# EAGLE design ADCMP607-step-gen (EAGLE 9.4.2)
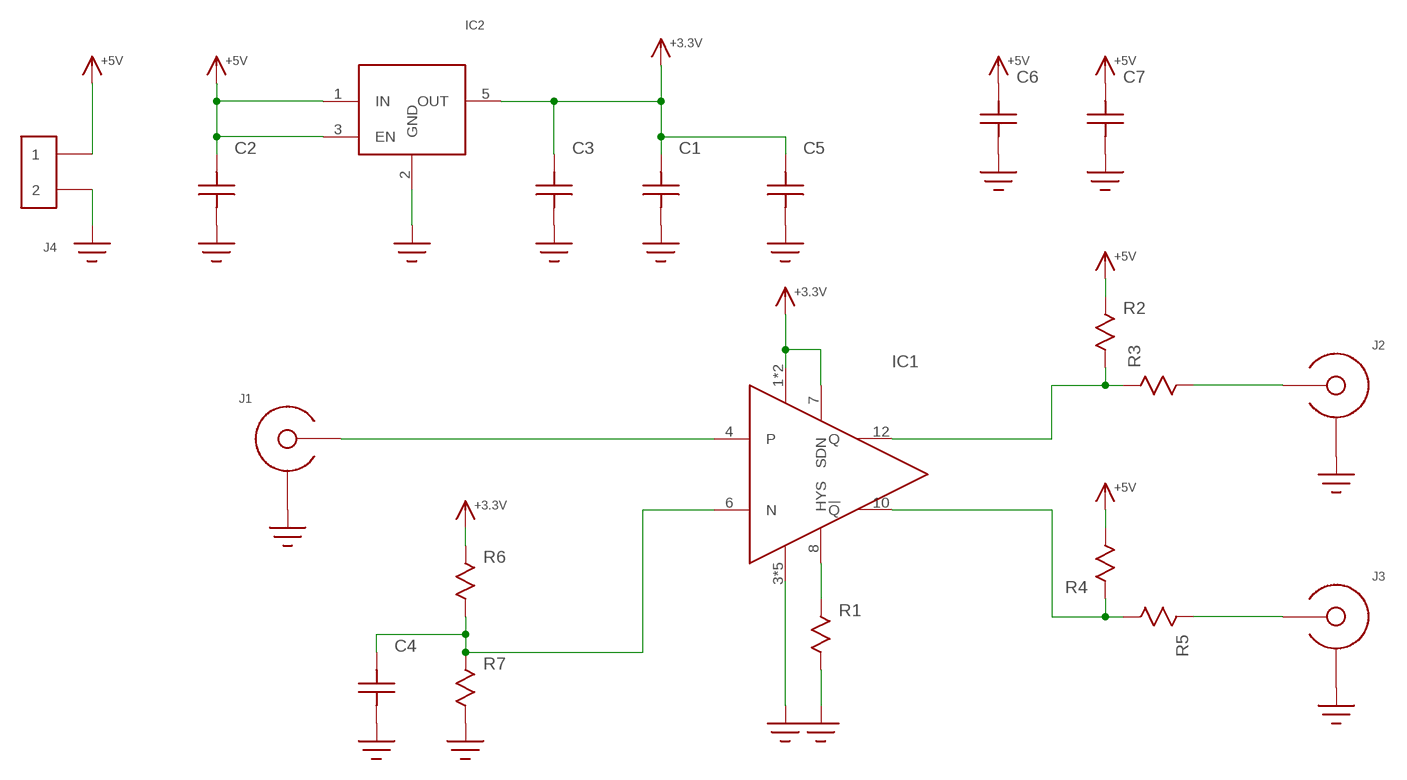
[diagram p0: schematic, sheet 1]

## Parts
C1  C  [C0402]
C2  C1206  [1206]
C3  C0603  [C0603]
C4  C0603  [C0603]
C5  C  [C0402]
C6  C  [C0402]
C7  C  [C0402]
IC1  ADCMP607  [QFN12-3X3]
IC2  MIC5501  [SOT23-5]
J1  SMA-EDGE-LAUNCH4L-4020-TAPER-FIXED  [SMA_EDGE_LAUNCH_4L_4020_TAPER_FIXED]
J2  SMA-EDGE-LAUNCH4L-4020-TAPER-FIXED  [SMA_EDGE_LAUNCH_4L_4020_TAPER_FIXED]
J3  SMA-EDGE-LAUNCH4L-4020-TAPER-FIXED  [SMA_EDGE_LAUNCH_4L_4020_TAPER_FIXED]
J4  HEADER_2PIN  [HEADER_2PIN]
R1  R0603  [R0603]
R2  R0402  [0402]
R3  R0402  [0402]
R4  R0402  [0402]
R5  R0402  [0402]
R6  R0603  [R0603]
R7  R0603  [R0603]

## Nets
+3.3V: C1.2 C3.P$2 C5.2 IC1.1(VCC) IC1.2(VCC) IC1.7(SDN) IC2.5(OUT) R6.P$1
+5V: C2.P$2 C6.2 C7.2 IC2.1(IN) IC2.3(EN) J4.1 R2.1 R4.2
GND: C1.1 C2.P$1 C3.P$1 C4.P$1 C5.1 C6.1 C7.1 IC1.3(VEE) IC1.5(VEE) IC1.9(VEE) IC1.11(VEE) IC1.EP(VEE) IC2.2(GND) J1.BOTTOM_GND(SHIELD) J1.GND@1(SHIELD) J1.GND@2(SHIELD) J1.GND@3(SHIELD) J1.GND@4(SHIELD) J1.GND@5(SHIELD) J1.GND@6(SHIELD) J1.GND@7(SHIELD) J1.GND@8(SHIELD) J1.GND@14(SHIELD) J1.GND@15(SHIELD) J1.GND@16(SHIELD) J1.GND@17(SHIELD) J1.GND_PAD1(SHIELD) J1.GND_PAD2(SHIELD) J1.P$1(SHIELD) J1.P$2(SHIELD) J2.BOTTOM_GND(SHIELD) J2.GND@1(SHIELD) J2.GND@2(SHIELD) J2.GND@3(SHIELD) J2.GND@4(SHIELD) J2.GND@5(SHIELD) J2.GND@6(SHIELD) J2.GND@7(SHIELD) J2.GND@8(SHIELD) J2.GND@14(SHIELD) J2.GND@15(SHIELD) J2.GND@16(SHIELD) J2.GND@17(SHIELD) J2.GND_PAD1(SHIELD) J2.GND_PAD2(SHIELD) J2.P$1(SHIELD) J2.P$2(SHIELD) J3.BOTTOM_GND(SHIELD) J3.GND@1(SHIELD) J3.GND@2(SHIELD) J3.GND@3(SHIELD) J3.GND@4(SHIELD) J3.GND@5(SHIELD) J3.GND@6(SHIELD) J3.GND@7(SHIELD) J3.GND@8(SHIELD) J3.GND@14(SHIELD) J3.GND@15(SHIELD) J3.GND@16(SHIELD) J3.GND@17(SHIELD) J3.GND_PAD1(SHIELD) J3.GND_PAD2(SHIELD) J3.P$1(SHIELD) J3.P$2(SHIELD) J4.2 R1.P$2 R7.P$2
N$1: IC1.8(HYS) R1.P$1
N$2 [13.5-microstrip]: J2.CENTER@1(CENTER) J2.P$3(CENTER) R3.2
N$3 [13.5-microstrip]: J3.CENTER@1(CENTER) J3.P$3(CENTER) R5.1
N$4 [13.5-microstrip]: IC1.12(Q) R2.2 R3.1
N$5 [13.5-microstrip]: IC1.10(!Q!) R4.1 R5.2
N$6: C4.P$2 IC1.6(N) R6.P$2 R7.P$1
N$7 [13.5-microstrip]: IC1.4(P) J1.CENTER@1(CENTER) J1.P$3(CENTER)

## Library data of the parts
C1-C7 = yapo:C
IC1 = yapo:ADCMP607
IC2 = yapo:MIC5501
J1-J3 = yapo:SMA-EDGE-LAUNCH
J4 = yapo:HEADER_2PIN
R1-R7 = yapo:R

## Net classes
1 12.5-6: width 0.318 mm, clearance 0.152 mm
2 13.5-microstrip: width 0.343 mm

## Board
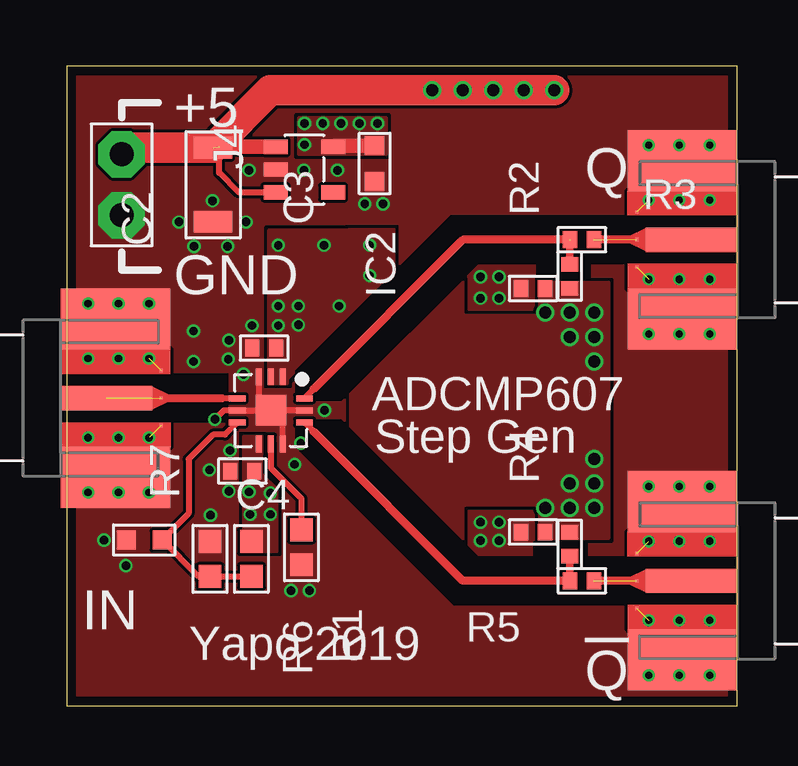
[diagram p1: board, top side]
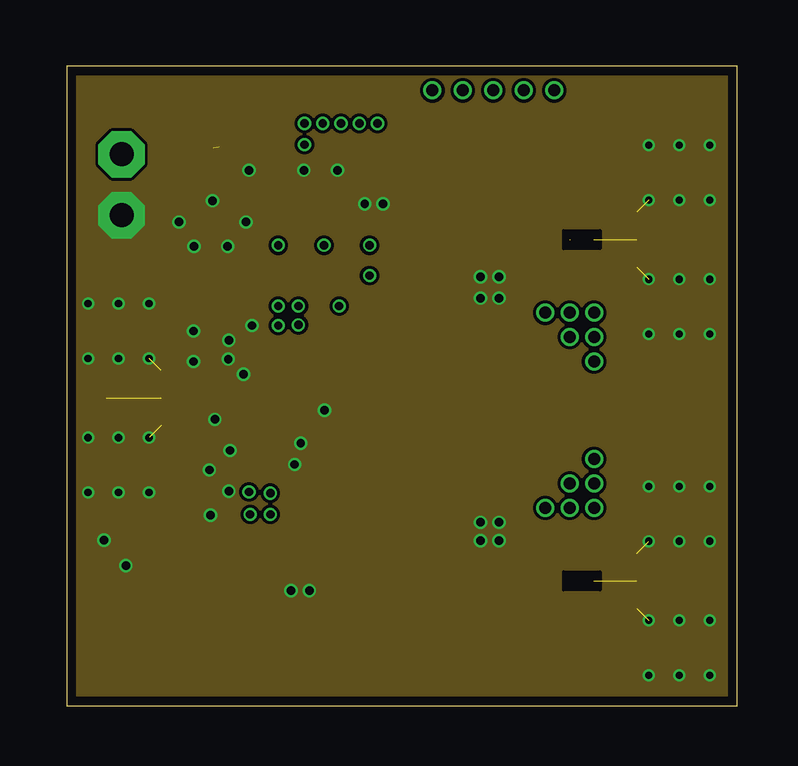
[diagram p2: board, inner layer Route2]
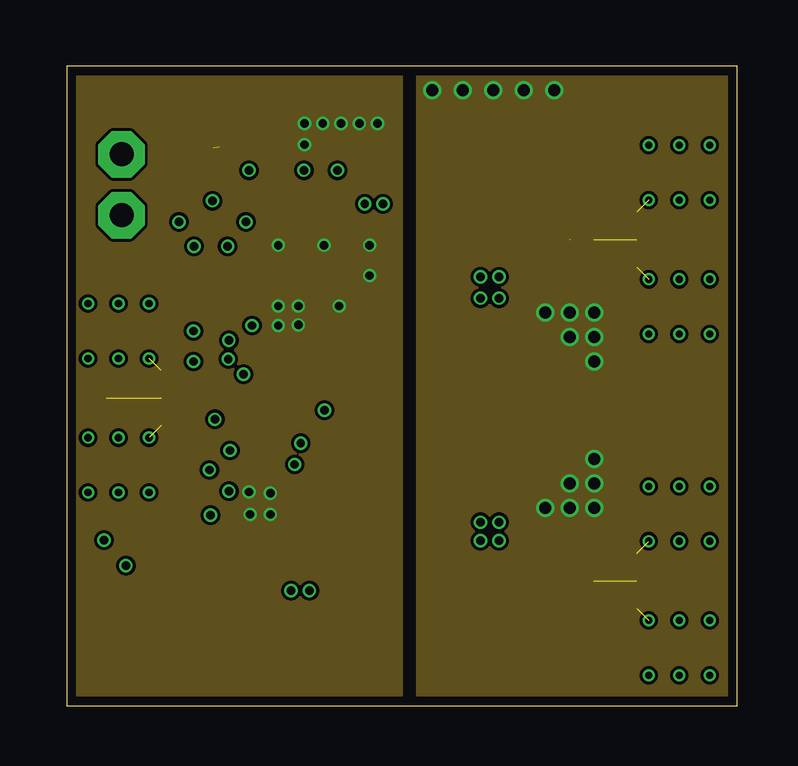
[diagram p3: board, inner layer Route15]
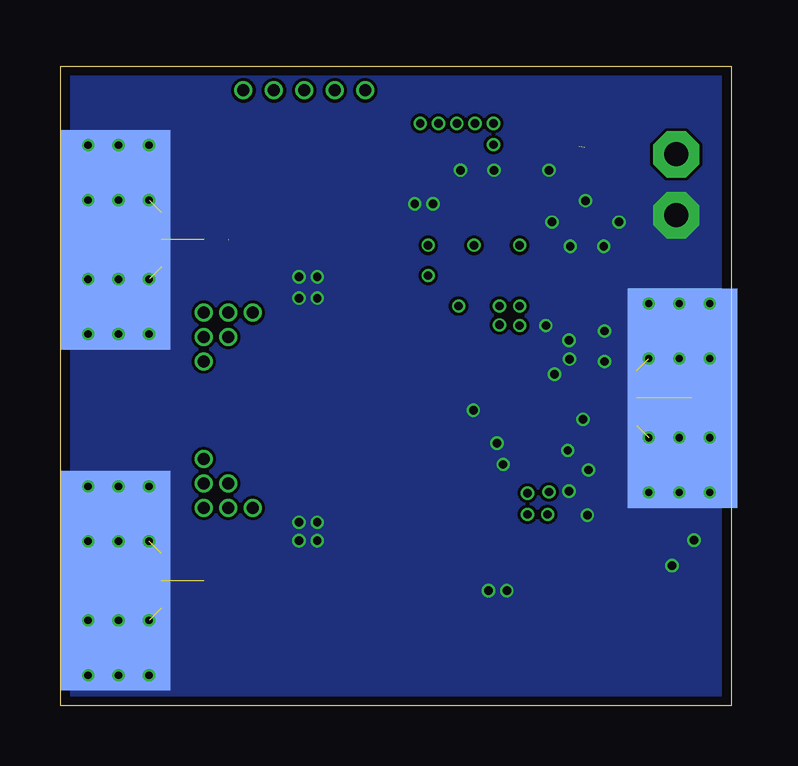
[diagram p4: board, bottom side, seen from below]

Size 27.94 x 26.67 mm. Coordinates in mm from the lower left corner, seen from the top.
Outline: 0,0 27.94,0 27.94,26.67 0,26.67 0,0
Copper layers (1*2*15*16): Top 0.035559375mm / dielectric 0.17018125mm / Route2 0.01778125mm / dielectric 47mil / Route15 0.01778125mm / dielectric 0.17018125mm / Bottom 0.035559375mm
Design rules "oshpark-4layer *": minimum track width 5mil, minimum drill 10mil, track to track 5mil, track to pad 5mil, pad to pad 5mil, via to via 5mil, smd to smd 5mil, copper to edge 15mil, drill to drill 6mil, minimum pad ring 4mil, minimum via ring 4mil, stop-mask expansion 2.5mil, vias tented up to drill 20mil, thermal gap 10mil

### Footprints (pad centres in the part's own frame; a part is rotated, then mirrored left to right if it is on the bottom)
C0402 = smd 0.6 x 0.7: 1 -0.5,0; 2 0.5,0
1206 = smd 0.9 x 1.6: P$1 -1.55,0; P$2 1.55,0
C0603 = smd 0.8 x 0.8: P$1 -0.75,0; P$2 0.75,0
QFN12-3X3 = smd 0.7 x 0.25: 1 -1.4,0.5; 2 -1.4,0; 3 -1.4,-0.5; 7 1.4,-0.5; 8 1.4,0; 9 1.4,0.5 | smd 0.25 x 0.7: 4 -0.5,-1.4; 5 0,-1.4; 6 0.5,-1.4; 10 0.5,1.4; 11 0,1.4; 12 -0.5,1.4 | smd 1.27 x 1.27: EP 0,0
SOT23-5 = smd 0.6 x 1: 1 -0.95,-1.2; 2 0,-1.2; 3 0.95,-1.2; 4 0.95,1.2; 5 -0.95,1.2
SMA_EDGE_LAUNCH_4L_4020_TAPER_FIXED = smd 4.572 x 9.144 bottom: BOTTOM_GND 2.286,0 | smd 3.81 x 1.016: CENTER@1 1.905,0 | drill 0.3: GND@1 1.143,3.937; GND@2 3.683,3.937; GND@3 1.143,1.651; GND@4 3.683,1.651; GND@5 1.143,-1.651; GND@6 3.683,-1.651; GND@7 1.143,-3.937; GND@8 3.683,-3.937; GND@14 2.413,3.937; GND@15 2.413,-3.937; GND@16 2.413,-1.651; GND@17 2.413,1.651 | smd 4.572 x 2.54: GND_PAD1 2.286,3.302; GND_PAD2 2.286,-3.302 | smd 0.127 x 0.127: P$1 4.191,1.143; P$2 4.191,-1.143; P$3 4.191,0
HEADER_2PIN = drill 1 pad 1.93 octagon: 1 -1.27,0; 2 1.27,0
R0603 = smd 0.95 x 0.95: P$1 -0.725,0; P$2 0.725,0
0402 = smd 0.6 x 0.7: 1 -0.5,0; 2 0.5,0

### Placement (x,y rotation side)
C1  8.23,14.91 0 top
C2  6.1,21.72 90 top
C3  12.83,22.61 90 top
C4  3.23,6.91 0 top
C5  7.32,9.78 0 top
C6  19.43,7.24 0 top
C7  19.43,17.4 0 top
IC1  8.51,12.32 270 top
IC2  9.91,22.35 270 top
J1  -0.25,12.83 0 top
J2  27.94,19.43 180 top
J3  27.94,5.21 180 top
J4  2.29,21.72 270 top
R1  9.78,6.6 270 top
R2  20.95,17.91 90 top
R3  21.46,19.43 0 top
R4  20.95,6.73 90 top
R5  21.46,5.21 180 top
R6  7.7,6.12 270 top
R7  5.97,6.12 90 top

### Tracks (layer width: path | path; a pad name or v marks a point on that pad's centre or on a via)
+3.3V  (via drill 0.35)
  Top 0.61: IC2.5 11.16,23.36 C3.P$2
  other vias: 9.65,16.66 8.81,15.85 9.65,15.88 8.81,16.66 7.59,8.92 8.48,8.86 7.65,7.98 8.48,7.98 9.91,23.39 9.91,24.28 10.67,24.28 11.43,24.28 12.19,24.28 12.95,24.28 8.81,19.2 12.62,19.2 12.62,17.93 11.35,16.66 10.72,19.2
  pour Top (no thermals): 8.41,19.82 8.41,13.41 8.43,13.44 9.22,13.44 9.22,13.61 13.65,18.04 13.65,19.87 9.86,19.82
  pour Top (no thermals): 7.37,11.23 7.37,6.43 8.76,6.43 8.76,9.04 8.13,9.67 8.15,11.23
  pour Route15 (no thermals): 0,0 13.97,0 13.97,26.67 0,26.67
  pour Top (no thermals): 9.65,22.99 13.34,22.99 13.34,24.51 9.65,24.51
+5V  (via drill 0.5)  (1 unrouted)
  Top 0.254: IC2.3 7.17,21.4 6.35,22.23 6.35,23.3
  Top 0.61: IC2.1 6.35,23.3
  Top 1.27: J4.1 2.57,23.27 C2.P$2 8.48,25.65 v20.32,25.65
  other vias: 15.24,25.65 16.51,25.65 17.78,25.65 19.05,25.65 20.95,16.38 21.97,16.38 20.95,8.26 21.97,8.26 21.97,14.35 19.94,16.38 19.94,8.26 21.97,10.29 20.95,15.37 21.97,15.37 20.95,9.27 21.97,9.27
  pour Top (rank 2, no thermals): 22.61,17.65 16,17.65 11.81,13.46 11.81,11.18 16,6.99 22.61,6.99
  pour Route15 (no thermals): 27.94,0 27.94,26.67 14.61,26.67 14.61,0
GND  (via drill 0.35)  (6 unrouted)
  Top 0.254: 8.26,12.32 IC1.5 6.55,12.32 v6.17,11.94 | 8.26,12.32 IC1.EP 8.89,12.32 | IC1.11 8.89,12.32 | IC1.3 8.01,12.56 8.26,12.32 | IC1.9 9.01,12.2 8.89,12.32
  other vias: 9.75,10.95 6.76,15.24 5.28,15.62 7.72,15.85 6.73,14.45 6.81,10.64 6.76,8.94 5.94,9.83 9.35,4.8 10.11,4.8 5.99,7.95 1.55,6.91 2.46,5.84 7.59,22.33 9.88,22.33 4.67,20.17 7.47,20.17 5.31,19.15 6.71,19.15 6.07,21.06 11.28,22.33 12.42,20.93 13.18,20.93 5.28,14.35 10.74,12.32 9.5,10.06 7.37,13.82 18.01,17.88 18.01,16.99 17.25,16.99 17.25,17.88 18.01,6.88 18.01,7.65 17.25,7.65 17.25,6.88
  pour Top (rank 3, no thermals): 0,0 27.94,0 27.94,26.67 0,26.67
  pour Route2 (no thermals): 0,0 27.94,0 27.94,26.67 0,26.67
  pour Bottom (no thermals): 0,0 27.94,0 27.94,26.67 0,26.67
  cutout Route2 (no thermals): 20.7,19.81 22.23,19.81 22.23,19.05 20.7,19.05
  cutout Route2 (no thermals): 20.7,5.59 22.23,5.59 22.23,4.83 20.7,4.83
  cutout Top (no thermals): 4.32,13.84 6.73,13.84 6.73,11.81 4.32,11.81
  cutout Top (no thermals): 9.53,12.7 9.53,13.97 16,20.45 23.37,20.45 23.37,18.41 17.14,18.41 11.43,12.7
  cutout Top (no thermals): 9.53,11.94 11.43,11.94 17.14,6.22 23.37,6.22 23.37,4.19 16.13,4.19 9.53,10.79
  pour Top (no thermals): 19.43,18.41 19.43,16.51 16.76,16.51 16.76,18.41
  pour Top (no thermals): 19.43,8.13 19.43,6.22 16.76,6.22 16.76,8.13
  cutout Top (no thermals): 19.56,18.8 19.56,17.78 21.84,17.78 21.84,18.8
  cutout Top (no thermals): 19.43,6.86 19.43,5.84 21.72,5.84 21.72,6.86
N$1
  Top 0.254: IC1.8 8.51,9.91 9.78,8.64 R1.P$1
N$2  (1 unrouted)
  Top 0.343: J2.CENTER@1 R3.2
N$3  (1 unrouted)
  Top 0.343: J3.CENTER@1 R5.1
N$4  (1 unrouted)
  Top 0.254: IC1.12 10.29,13.21
  Top 0.318: R2.2 R3.1
  Top 0.343: R3.1 16.51,19.43 10.29,13.21
N$5
  Top 0.254: IC1.10 10.29,11.44 10.29,11.43
  Top 0.318: R4.1 20.96,6.22 R5.2
  Top 0.343: 10.29,11.43 16.51,5.21 R5.2
N$6
  Top 0.254: IC1.6 6.59,11.3 6.1,11.3 5.08,10.29 5.08,8.01 C4.P$2 5.49,5.4 R7.P$1 R6.P$2
N$7  (1 unrouted)
  Top 0.254: IC1.4 6.36,12.82 6.35,12.83
  Top 0.343: J1.CENTER@1 6.35,12.83 6.48,12.83

### Text on the board
tPlace: +5 | Q | GND | ADCMP607 | Step Gen | IN | Yapo 2019 | !Q!